# EAGLE design photo-relay (EAGLE 7.5.0)
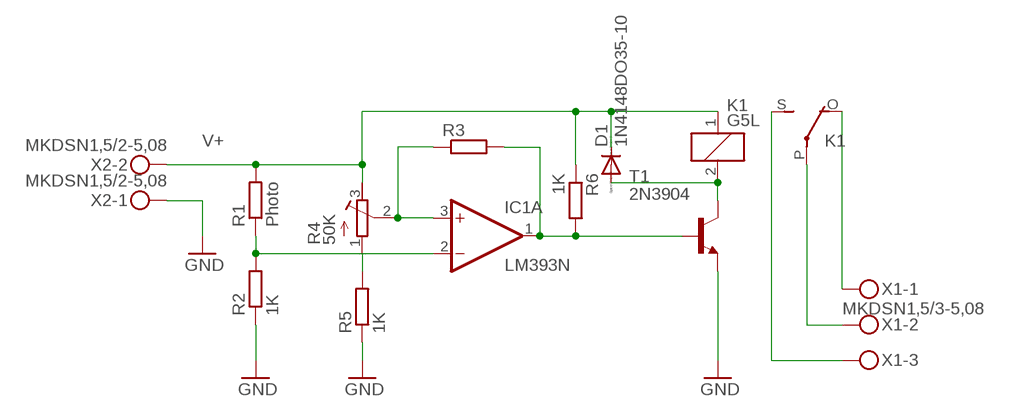
[diagram p0: schematic, sheet 1]

## Parts
D1  1N4148DO35-10  [DO35-10]
IC1  LM393N  [DIL08]
K1  G5L  [G5LE]
R1  Photo  R-EU_0204/7  [0204/7]
R2  1K  R-EU_0204/7  [0204/7]
R3  R-EU_0204/7  [0204/7]
R4  50K  R-TRIMM64W  [RTRIM64W]
R5  1K  R-EU_0204/7  [0204/7]
R6  1K  R-EU_0204/7  [0204/7]
T1  2N3904  [TO92]
X1  MKDSN1,5/3-5,08  [MKDSN1,5/3-5,08]
X2  MKDSN1,5/2-5,08  [MKDSN1,5/2-5,08]

## Nets
GND: R2.1 R5.1 T1.3(E) X2.1
N$1: IC1.1(A:OUT) R3.2 R6.2 T1.2(B)
N$2: IC1.3(A:+IN) R3.1 R4.2(S)
N$3: R4.1(A) R5.2
N$4: IC1.2(A:-IN) R1.1 R2.2
N$5: K1.P(2:P) X1.2
N$7: D1.A K1.2 T1.1(C)
N$8: K1.S(2:S) X1.3
N$9: K1.O(2:O) X1.1
V+: D1.C K1.1 R1.2 R4.3(E) R6.1 X2.2
Unconnected: IC1.5(B:+IN) IC1.6(B:-IN) IC1.7(B:OUT)

## Power pins joined to a net without a drawn wire
V+: IC1.8(P:V+)
V-: IC1.4(P:V-)

## Library data of the parts
D1 = diode:1N4148: DIODE high speed (Philips)
IC1 = linear:LM393: COMPARATOR
K1 = relay:G5L: RELAY 1 x switch, 10 A/120 V AC, 8 A/30 V ADC, Omron; OC_FARNELL: unknown; OC_NEWARK: unknown
R1-R3 R5 R6 = rcl:R-EU_: RESISTOR, European symbol
R4 = rcl:R-TRIMM: Trimm resistor
T1 = transistor:2N3904: NPN TRANSISTOR
X1 = con-phoenix-508:MKDSN1,5/3-5,08: MKDSN 1,5/ 3-5,08 Printklemme Nennstrom: 13,5 A Nennspannung: 250 V Rastermaß: 5,08 mm Polzahl: 3 Anschlussart: Schraubanschluss Montage: Löten Anschlussrichtung Leiter/Platine: 0 ° Artikelnummer: 1729131 Source: http://eshop.phoenixcontact.com .. 1729131.pdf
X2 = con-phoenix-508:MKDSN1,5/2-5,08: MKDSN 1,5/ 2-5,08 Printklemme Nennstrom: 13,5 A Nennspannung: 250 V Rastermaß: 5,08 mm Polzahl: 2 Anschlussart: Schraubanschluss Montage: Löten Anschlussrichtung Leiter/Platine: 0 ° Artikelnummer: 1729128 Source: http://eshop.phoenixcontact.com .. 1729128.pdf

## Board
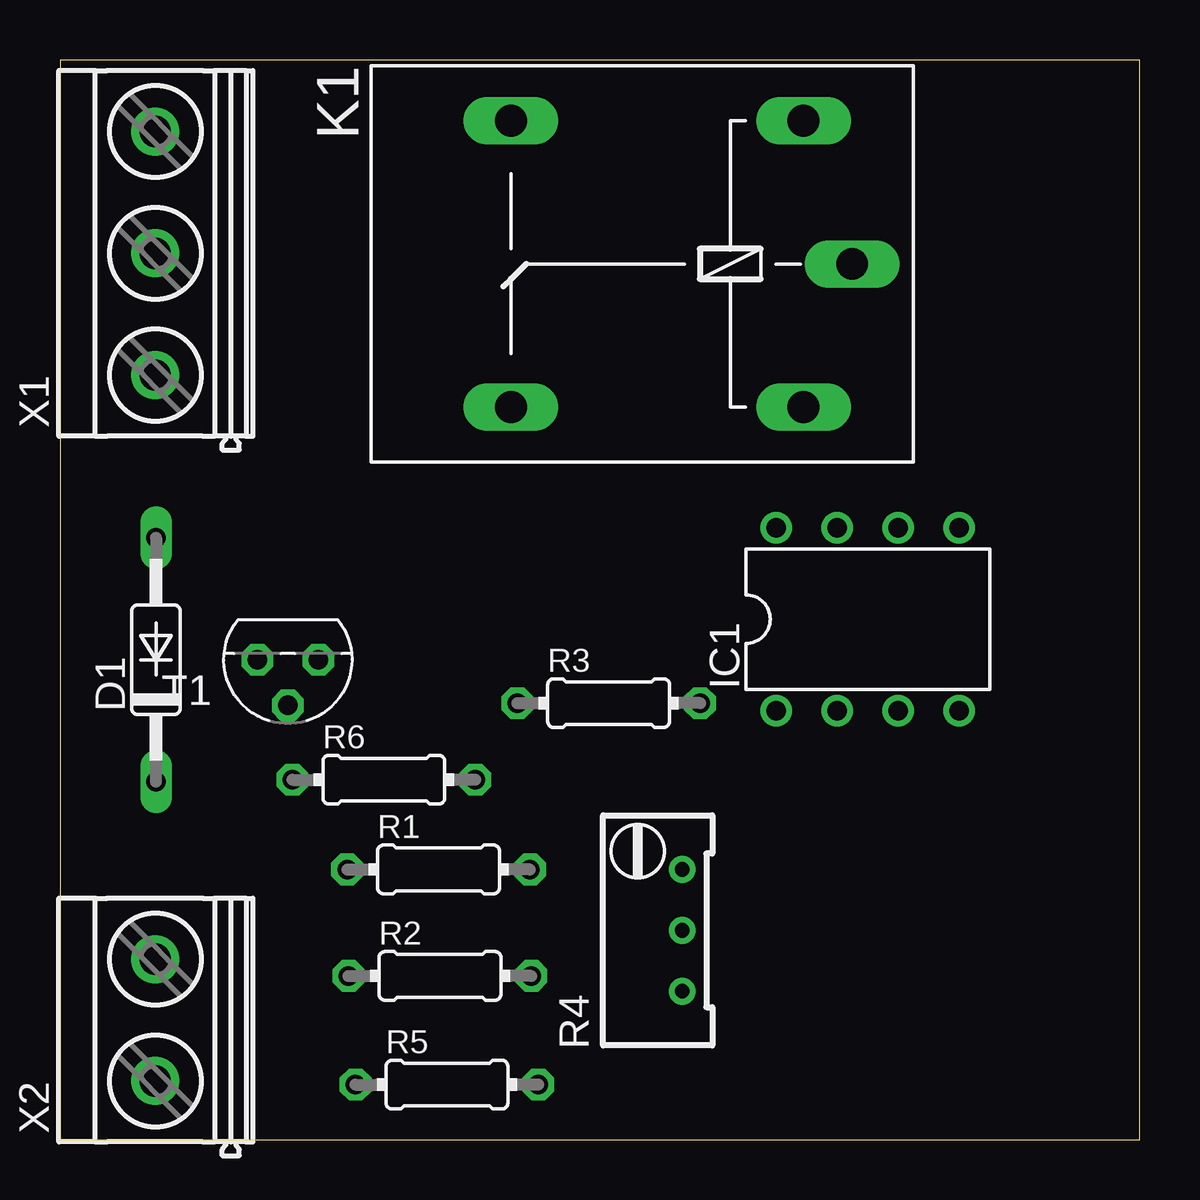
[diagram p1: board, top side]
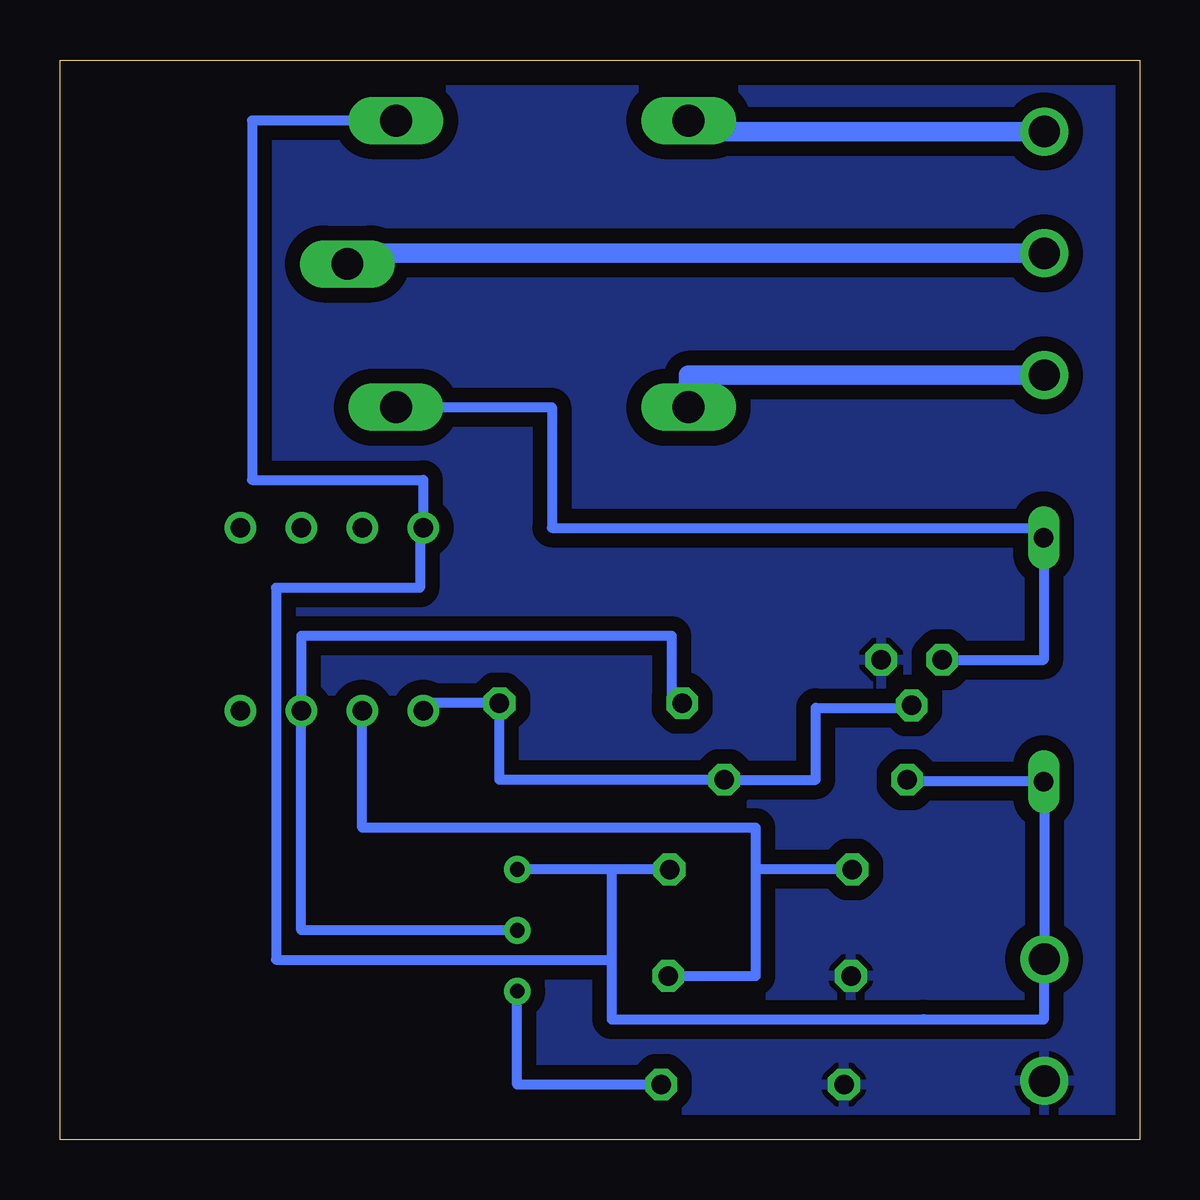
[diagram p2: board, bottom side, seen from below]

Size 45 x 45 mm. Coordinates in mm from the lower left corner, seen from the top.
Outline: 0,0 45,0 45,45 0,45 0,0
Copper layers (1*16): Top 0.035mm / dielectric 1.5mm / Bottom 0.035mm
Design rules "default": minimum track width 10mil, minimum drill 24mil, track to track 8mil, track to pad 8mil, pad to pad 8mil, via to via 8mil, smd to smd 8mil, copper to edge 40mil, drill to drill 8mil, minimum pad ring 10mil, minimum via ring 8mil, stop-mask expansion 4mil, vias tented up to drill 0mil, thermal gap 10mil

### Footprints (pad centres in the part's own frame; a part is rotated, then mirrored left to right if it is on the bottom)
DO35-10 = drill 0.813 long: A 5.08,0; C -5.08,0
DIL08 = drill 0.813 pad 1.27: 1 -3.81,-3.81; 2 -1.27,-3.81; 3 1.27,-3.81; 4 3.81,-3.81; 5 3.81,3.81; 6 1.27,3.81; 7 -1.27,3.81; 8 -3.81,3.81
G5LE = drill 1.321 long: 1 -7.493,-5.969; 2 -7.493,5.969; O 4.699,5.969; P -9.525,0; S 4.699,-5.969
0204/7 = drill 0.813 octagon: 1 -3.81,0; 2 3.81,0
RTRIM64W = drill 0.61: 1 1.27,-2.54; 2 1.27,0; 3 1.27,2.54
TO92 = drill 0.813 octagon: 1 1.27,0; 2 0,1.905; 3 -1.27,0
MKDSN1,5/3-5,08 = drill 1.3 pad 2: 1 -7.641,0.025; 2 -2.561,0.025; 3 2.519,0.025
MKDSN1,5/2-5,08 = drill 1.3 pad 2: 1 -2.561,0.025; 2 2.519,0.025

### Placement (x,y rotation side)
D1  4,20 90 top
IC1  33.67,21.69 0 top
K1  23.5,36.5 180 top
R1  15.78,11.26 0 top
R2  15.84,6.82 0 top
R3  22.87,18.19 0 top
R4  24.67,8.72 0 top
R5  16.13,2.29 0 top
R6  13.5,15 0 top
T1  9.5,20 180 top
X1  4,39.5 90 top
X2  4,5 90 top

### Tracks (layer width: path | path; a pad name or v marks a point on that pad's centre or on a via)
GND
  pour Bottom (isolate 0.61): 45,45 45,0 0,0 0,45
N$1
  Bottom 0.406: IC1.1 29.86,18.19 R3.2 26.68,15 R6.2 13.5,15 13.5,18 9.5,18 T1.2
N$2
  Bottom 0.406: R4.2 34.94,8.72 IC1.3 34.94,21 19.5,21 19.5,18.19 R3.1
N$3
  Bottom 0.406: R5.2 25.94,2.29 R4.1
N$4
  Bottom 0.406: R1.1 16,11.26 | 16,11.26 16,13 32.4,13 IC1.2 | R2.2 16,6.82 16,11.26
N$5
  Bottom 0.813: X1.2 33.02,36.94 K1.P
N$7
  Bottom 0.406: T1.1 4,20 D1.A 4,25.5 24.5,25.5 24.5,30.53 K1.2
N$8
  Bottom 0.813: X1.3 18.8,42.02 K1.S
N$9
  Bottom 0.813: X1.1 18.8,31.86 K1.O
V+
  Bottom 0.406: R1.2 22,11.26 | 22,11.26 R4.3 | 22,7.5 22,5 9,5 | 22,7.5 22,11.26 | 9,5.03 9,5 | 9,5 4,5 4,7.52 X2.2 3.98,14.92 D1.C 9.69,14.92 R6.1 9.5,15 | 22,7.5 36,7.5 36,23 30,23 30,25.5 IC1.8 29.86,27.5 37,27.5 37,42.47 K1.1